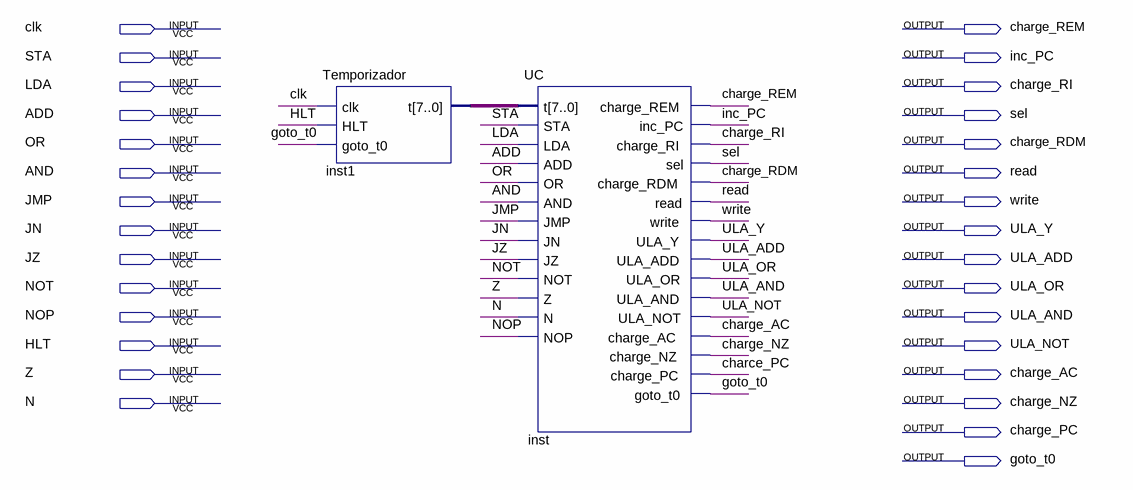
[diagram p0: schematic sheet]
// Quartus schematic TopLevel.bdf as structural Verilog: 2 symbols, 30 pins
module TopLevel (
  input  clk,
  input  STA,
  input  LDA,
  input  ADD,
  input  OR,
  input  AND,
  input  JMP,
  input  JN,
  input  JZ,
  input  NOT,
  input  NOP,
  input  HLT,
  input  Z,
  input  N,
  output charge_REM,
  output inc_PC,
  output charge_RI,
  output sel,
  output charge_RDM,
  output read,
  output write,
  output ULA_Y,
  output ULA_ADD,
  output ULA_OR,
  output ULA_AND,
  output ULA_NOT,
  output charge_AC,
  output charge_NZ,
  output charge_PC,
  output goto_t0
);

  wire charce_PC;
  wire [7:0] inst1_t;

  Temporizador inst1 (.clk(clk), .HLT(HLT), .goto_t0(goto_t0), .t(inst1_t));
  UC inst (
    .t(inst1_t), .STA(STA), .LDA(LDA), .ADD(ADD), .OR(OR), .AND(AND), .JMP(JMP), .JN(JN), .JZ(JZ), .NOT(NOT),
    .Z(Z), .N(N), .NOP(NOP), .charge_REM(charge_REM), .inc_PC(inc_PC), .charge_RI(charge_RI), .sel(sel),
    .charge_RDM(charge_RDM), .read(read), .write(write), .ULA_Y(ULA_Y), .ULA_ADD(ULA_ADD), .ULA_OR(ULA_OR),
    .ULA_AND(ULA_AND), .ULA_NOT(ULA_NOT), .charge_AC(charge_AC), .charge_NZ(charge_NZ),
    .charge_PC(charce_PC), .goto_t0(goto_t0));
endmodule
